# EAGLE design SparkFun_Qwiic_Thermocouple_Amplifier_Screw_Terminals (EAGLE 9.4.1)
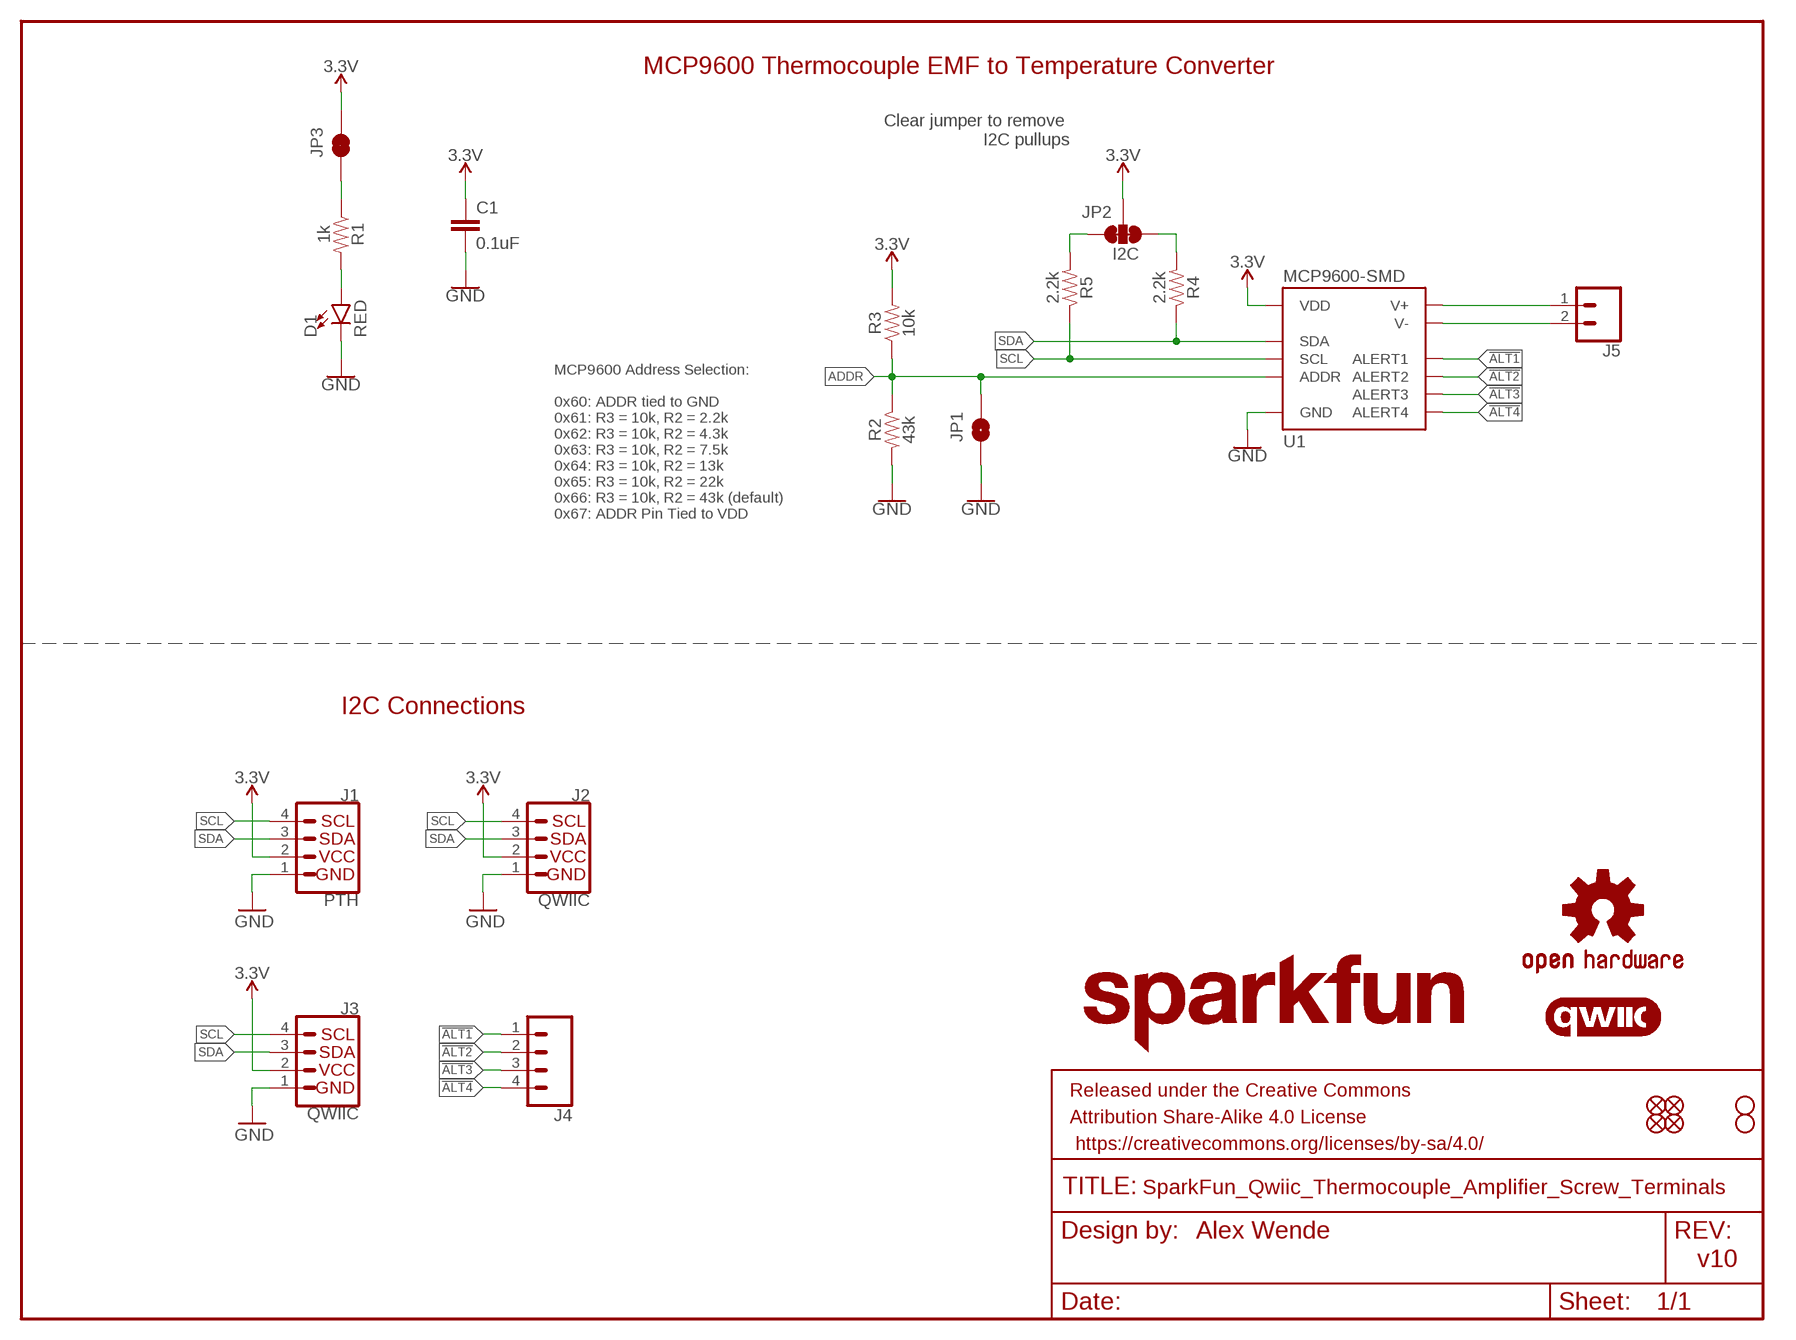
[diagram p0: schematic, sheet 1]

## Parts
C1  0.1uF  0.1UF-0603-25V-(+80/-20%)  [0603]
D1  RED  LED-RED0603  [LED-0603]
FD1  FIDUCIALUFIDUCIAL  [FIDUCIAL-MICRO]
FD2  FIDUCIALUFIDUCIAL  [FIDUCIAL-MICRO]
FD3  FIDUCIALUFIDUCIAL  [FIDUCIAL-MICRO]
FD4  FIDUCIALUFIDUCIAL  [FIDUCIAL-MICRO]
FRAME1  FRAME-LETTER  [CREATIVE_COMMONS]
J1  PTH  I2C_STANDARD_NO_SILK  [1X04_NO_SILK]
J2  QWIIC  QWIIC_CONNECTORJS-1MM  [JST04_1MM_RA]
J3  QWIIC  QWIIC_CONNECTORJS-1MM  [JST04_1MM_RA]
J4  CONN_041X04_NO_SILK  [1X04_NO_SILK]
J5  CONN_023.5MM  [SCREWTERMINAL-3.5MM-2]
JP1  JUMPER-SMT_2_NO_SILK  [SMT-JUMPER_2_NO_SILK]
JP2  I2C  JUMPER-SMT_3_2-NC_TRACE_SILK  [SMT-JUMPER_3_2-NC_TRACE_SILK]
JP3  JUMPER-SMT_2_NC_TRACE_SILK  [SMT-JUMPER_2_NC_TRACE_SILK]
JP8  STAND-OFF  [STAND-OFF]
JP9  STAND-OFF  [STAND-OFF]
LOGO1  OSHW-LOGOMINI  [OSHW-LOGO-MINI]
LOGO2  SFE_LOGO_NAME.1_INCH  [SFE_LOGO_NAME_.1]
LOGO3  QWIIC_LOGO_5MM  [QWIIC_5MM]
R1  1k  1KOHM-0603-1/10W-1%  [0603]
R2  43k  43KOHM-0603-1/10W-1%  [0603]
R3  10k  10KOHM-0603-1/10W-1%  [0603]
R4  2.2k  2.2KOHM-0603-1/10W-1%  [0603]
R5  2.2k  2.2KOHM-0603-1/10W-1%  [0603]
U1  MCP9600-SMD  [MQFN-20]

## Nets
3.3V: C1.1 J1.2 J2.2 J3.2 JP2.2 JP3.1 R3.2 U1.8(VDD)
!ALT1: J4.1 U1.11(ALERT1)
!ALT2: J4.2 U1.12(ALERT2)
!ALT3: J4.3 U1.14(ALERT3)
!ALT4: J4.4 U1.15(ALERT4)
ADDR: JP1.1 R2.1 R3.1 U1.16(ADDR)
GND: C1.2 D1.C J1.1 J2.1 J3.1 JP1.2 R2.2 U1.1(GND) U1.3(GND) U1.5(GND) U1.6(GND) U1.7(GND) U1.9(GND) U1.10(GND) U1.13(GND) U1.17(GND) U1.18(GND) U1.21(GND)
N$1: D1.A R1.2
N$2: JP2.1 R5.2
N$3: JP2.3 R4.2
N$4: J5.1 U1.2(V+)
N$5: J5.2 U1.4(V-)
N$6: JP3.2 R1.1
SCL: J1.4 J2.4 J3.4 R5.1 U1.19(SCL)
SDA: J1.3 J2.3 J3.3 R4.1 U1.20(SDA)

## Notes on the sheet
- MCP9600 Thermocouple EMF to Temperature Converter
- Clear jumper to remove 
  I2C pullups
- MCP9600 Address Selection:
  
  0x60: ADDR tied to GND
  0x61: R3 = 10k, R2 = 2.2k
  0x62: R3 = 10k, R2 = 4.3k 
  0x63: R3 = 10k, R2 = 7.5k
  0x64: R3 = 10k, R2 = 13k 
  0x65: R3 = 10k, R2 = 22k
  0x66: R3 = 10k, R2 = 43k (default)
  0x67: ADDR Pin Tied to VDD
- I2C Connections
- Alex Wende
- v10

## Library data of the parts
C1 = SparkFun-Capacitors:0.1UF: 0.1µF ceramic capacitors A capacitor is a passive two-terminal electrical component used to store electrical energy temporarily in an electric field.; PROD_ID: CAP-00810
D1 = SparkFun-LED:LED-RED: Red SMD LED Used in manufacturing of most products at SparkFun Packages: 0603 - SMD 0603 package [Product Link] <http://docs.avagotech.com/docs/AV02-0551EN> 0603 SMART - SMD 0603 SMART package ( more efficient and expensive)[Product Link] <http://www.osram-os.com/Graphics/XPic2/00077099_0.pdf> 1206 - SMD1206 package [Product Link] <https://www.sparkfun.com/datasheets/DevTools/LilyPad/Q150OVS4.pdff> SparkFun Products: Pro Mini 328 -5V <https://www.sparkfun.com/products/821> RedBoard <https://www.sparkfun.com/products/12757> IOIO-OTG <https://www.sparkfun.com/products/13613>; PROD_ID: DIO-00819
FD1-FD4 = SparkFun-Aesthetics:FIDUCIAL: Fiducial Alignment Points Point-of-reference for pick-and-place machines and other optical instruments.
FRAME1 = SparkFun-Aesthetics:FRAME-LETTER: Schematic Frame - Letter Standard 8.5x11 US Letter frame
J1 = SparkFun-Connectors:I2C_STANDARD: SparkFun I2C Standard Pinout Header SparkFun has standardized on a pinout for all I2C based sensor breakouts. This pinout allows I2C boards to be plugged directly into the headers on Arduino Uno compatible boards, and to be daisy chained easily. Example SparkFun Products: SparkFun Atmospheric Sensor Breakout - BME280 <https://www.sparkfun.com/products/13676> SparkFun Altitude/Pressure Sensor Breakout - MPL3115A2 <https://www.sparkfun.com/products/11084> SparkFun TOF Range Finder Sensor - VL6180 <https://www.sparkfun.com/products/12785>
J2 J3 = SparkFun-Connectors:QWIIC_CONNECTOR: SparkFun I2C Standard Qwiic Connector An SMD 1mm pitch JST connector makes it easy and quick (get it? Qwiic?) to connect I2C devices to each other. The Qwiic system <http://www.sparkfun.com/qwiic> enables fast and solderless connection between popular platforms and various sensors and actuators. We carry 200mm <https://www.sparkfun.com/products/14204>, 100mm <https://www.sparkfun.com/products/14205>, 50mm <https://www.sparkfun.com/products/14206>, and breadboard friendly <https://www.sparkfun.com/products/14207> Qwiic cables. We also offer 10 pcs strips <https://www.sparkfun.com/products/14323> the SMD connectors.; PROD_ID: CONN-13694; VALUE: QWIIC_RIGHT_ANGLE
J4 = SparkFun-Connectors:CONN_04: Multi connection point. Often used as Generic Header-pin footprint for 0.1 inch spaced/style header connections On any of the 0.1 inch spaced packages, you can populate with these: Break Away Headers - Straight <https://www.sparkfun.com/products/116> (PRT-00116) Break Away Male Headers - Right Angle <https://www.sparkfun.com/products/553> (PRT-00553) Female Headers <https://www.sparkfun.com/products/115> (PRT-00115) Break Away Headers - Machine Pin <https://www.sparkfun.com/products/117> (PRT-00117) Break Away Female Headers - Swiss Machine Pin <https://www.sparkfun.com/products/743> (PRT-00743) For SCREWTERMINALS and SPRING TERMINALS visit here: Screw Terimnals on SparkFun.com <https://www.sparkfun.com/search/results?term=Screw+Terminals> (5mm/3.5mm/2.54mm spacing) This device is also useful as a general connection point to wire up your design to another part of your project. Our various solder wires solder well into these plated through hole pads. Hook-Up Wire - Assortment (Stranded, 22 AWG) <https://www.sparkfun.com/products/11375> (PRT-11375) Hook-Up Wire - Assortment (Solid Core, 22 AWG) <https://www.sparkfun.com/products/11367> (PRT-11367) View the entire wire category on our website here <https://www.sparkfun.com/categories/141> Special notes: Molex polarized connector foot print use with SKU : PRT-08231 with associated crimp pins and housings. 1MM SMD Version SKU: PRT-10208; PROD_ID: CONN-09696
J5 = SparkFun-Connectors:CONN_02: Multi connection point. Often used as Generic Header-pin footprint for 0.1 inch spaced/style header connections On any of the 0.1 inch spaced packages, you can populate with these: Break Away Headers - Straight <https://www.sparkfun.com/products/116> (PRT-00116) Break Away Male Headers - Right Angle <https://www.sparkfun.com/products/553> (PRT-00553) Female Headers <https://www.sparkfun.com/products/115> (PRT-00115) Break Away Headers - Machine Pin <https://www.sparkfun.com/products/117> (PRT-00117) Break Away Female Headers - Swiss Machine Pin <https://www.sparkfun.com/products/743> (PRT-00743) For SCREWTERMINALS and SPRING TERMINALS visit here: Screw Terimnals on SparkFun.com <https://www.sparkfun.com/search/results?term=Screw+Terminals> (5mm/3.5mm/2.54mm spacing) This device is also useful as a general connection point to wire up your design to another part of your project. Our various solder wires solder well into these plated through hole pads. Hook-Up Wire - Assortment (Stranded, 22 AWG) <https://www.sparkfun.com/products/11375> (PRT-11375) Hook-Up Wire - Assortment (Solid Core, 22 AWG) <https://www.sparkfun.com/products/11367> (PRT-11367) View the entire wire category on our website here <https://www.sparkfun.com/categories/141> Special notes: Molex polarized connector foot print use with: PRT-08233 with associated crimp pins and housings. 2.54_SCREWTERM for use with PRT-10571. 3.5mm Screw Terminal footprints for PRT-08084 5mm Screw Terminal footprints for use with PRT-08432; PROD_ID: CONN-08399
JP1 = SparkFun-Jumpers:JUMPER-SMT_2_NO: Normally open jumper This jumper has two pads in close proximity to each other. Apply solder to close the connection. Round pads are easier to solder for beginners, but are a lot larger. SparkFun Product that uses the round pads: SparkFun EL Sequencer <https://www.sparkfun.com/products/12781>
JP2 = SparkFun-Jumpers:JUMPER-SMT_3_2-NC_TRACE: Normally closed trace jumper (2 of 2 connections) This jumper has a trace between all three pads so they are normally closed (NC). Use a razor knife to open the connection(s). For best results follow the IPC guidelines for cutting traces: Cutout at least 0.063 mm (0.005 in). Remove all loose material to clean up the cut area. Seal the cut with an approved epoxy. Reapply solder to reclose the connection(s).
JP3 = SparkFun-Jumpers:JUMPER-SMT_2_NC_TRACE: Normally closed trace jumper This jumper has a trace between two pads so it's normally closed (NC). Use a razor knife to open the connection. For best results follow the IPC guidelines for cutting traces: Cutout at least 0.063 mm (0.005 in). Remove all loose material to clean up the cut area. Seal the cut with an approved epoxy. Reapply solder to reclose the connection.
JP8 JP9 = SparkFun:STAND-OFF: Stand Off This is the mechanical footprint for a #4 phillips button head screw. Use the keepout ring to avoid running the screw head into surrounding components. SKU : PRT-00447
LOGO1 = SparkFun-Aesthetics:OSHW-LOGO: Open-Source Hardware (OSHW) Logo This logo indicates the piece of hardware it is found on incorporates a OSHW license and/or adheres to the definition of open source hardware found here: http://freedomdefined.org/OSHW
LOGO2 = SparkFun-Aesthetics:SFE_LOGO_NAME: SparkFun Font Logo This is the SparkFun name logo. The logo on the schematic will always be the same size; the package variant is the height of the flame part of the logo (or the height the flame would be, if it were drawn). Default layer for the logo on the board is tSilk.
LOGO3 = SparkFun-Aesthetics:QWIIC_LOGO: Qwiic Logos for placement on schematic and PCB. The 5.5mm silk logo is best for placing next to Qwiic connector.
R1 = SparkFun-Resistors:1KOHM: 1kΩ resistor A resistor is a passive two-terminal electrical component that implements electrical resistance as a circuit element. Resistors act to reduce current flow, and, at the same time, act to lower voltage levels within circuits. - Wikipedia; PROD_ID: RES-07856
R2 = SparkFun-Resistors:43KOHM: 43kΩ resistor A resistor is a passive two-terminal electrical component that implements electrical resistance as a circuit element. Resistors act to reduce current flow, and, at the same time, act to lower voltage levels within circuits. - Wikipedia; PROD_ID: RES-07858
R3 = SparkFun-Resistors:10KOHM: 10kΩ resistor A resistor is a passive two-terminal electrical component that implements electrical resistance as a circuit element. Resistors act to reduce current flow, and, at the same time, act to lower voltage levels within circuits. - Wikipedia; PROD_ID: RES-00824
R4 R5 = SparkFun-Resistors:2.2KOHM: 2.2kΩ resistor A resistor is a passive two-terminal electrical component that implements electrical resistance as a circuit element. Resistors act to reduce current flow, and, at the same time, act to lower voltage levels within circuits. - Wikipedia; PROD_ID: RES-08272
U1 = SparkFun-IC-Conversion:MCP9600: Thermocouple EMF to Temperature Converter; PROD_ID: IC-14644

## Board
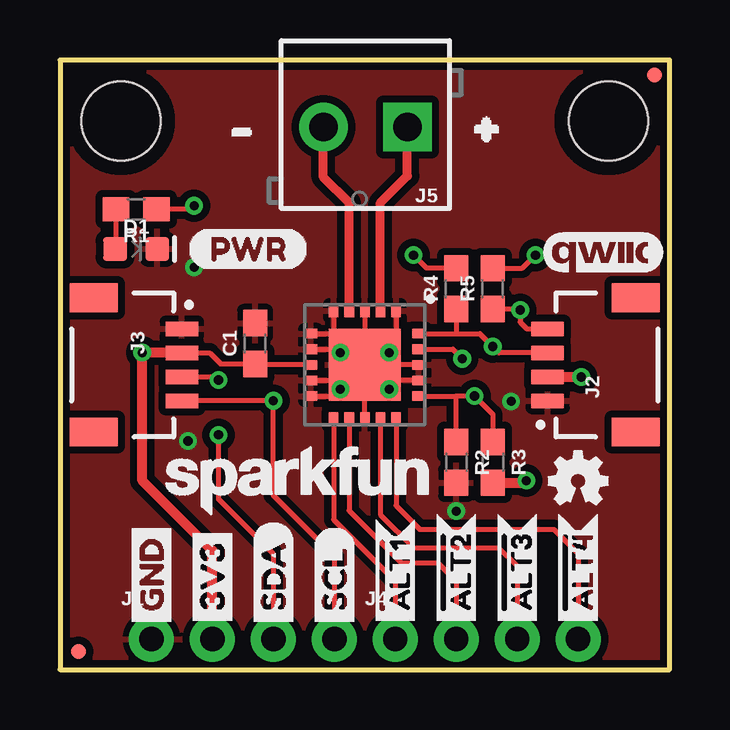
[diagram p1: board, top side]
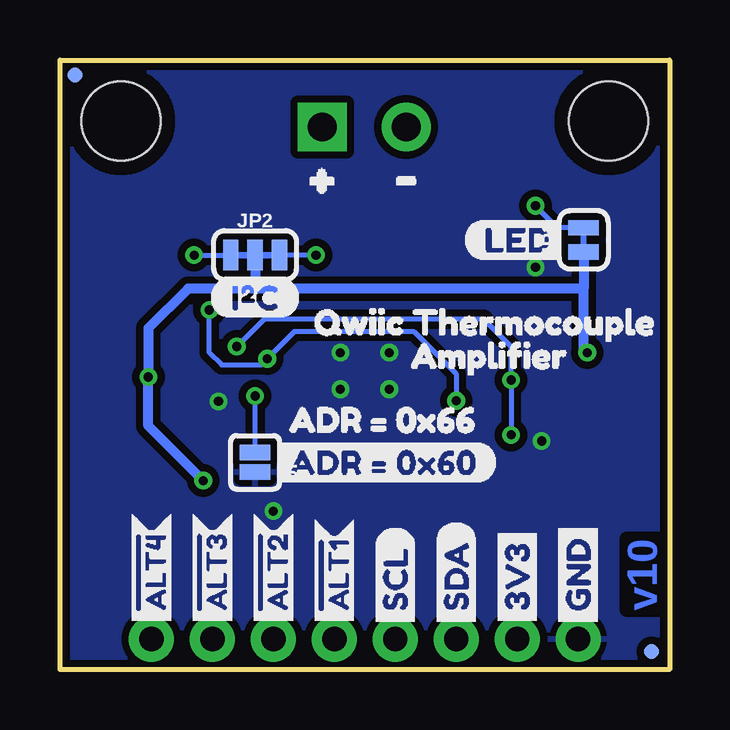
[diagram p2: board, bottom side, seen from below]

Size 25.4 x 25.4 mm. Coordinates in mm from the lower left corner, seen from the top.
Outline: 0,0 25.4,0 25.4,25.4 0,25.4 0,0
Copper layers (1*16): Top 0.035mm / dielectric 1.5mm / Bottom 0.035mm
Design rules "SparkFun-2-layer-TIGHT": minimum track width 7mil, minimum drill 15mil, track to track 7mil, track to pad 7mil, pad to pad 7mil, via to via 7mil, smd to smd 7mil, copper to edge 7mil, drill to drill 7mil, minimum pad ring 7mil, minimum via ring 7mil, stop-mask expansion 4mil, vias tented up to drill 25mil, thermal gap 10mil
tRestrict: 3 lines

### Footprints (pad centres in the part's own frame; a part is rotated, then mirrored left to right if it is on the bottom)
0603 = smd 1.1 x 1: 1 -0.85,0; 2 0.85,0
LED-0603 = smd 1 x 1: A -0.877,0; C 0.877,0
FIDUCIAL-MICRO = smd 0.635 x 0.635: 1 0,0
1X04_NO_SILK = drill 1.016 pad 1.88: 1 0,0; 2 2.54,0; 3 5.08,0; 4 7.62,0
JST04_1MM_RA = smd 0.6 x 1.35: 1 -1.5,0; 2 -0.5,0; 3 0.5,0; 4 1.5,0 | smd 1.2 x 2: NC1 2.8,-3.675; NC2 -2.8,-3.675
SCREWTERMINAL-3.5MM-2 = drill 1.2 pad 2.032 square: 1 0,0 | drill 1.2 pad 2.032: 2 3.5,0
SMT-JUMPER_2_NO_SILK = smd 0.635 x 1.27: 1 -0.406,0; 2 0.406,0
SMT-JUMPER_3_2-NC_TRACE_SILK = smd 0.635 x 1.27: 1 -1.016,0; 2 0,0; 3 1.016,0
SMT-JUMPER_2_NC_TRACE_SILK = smd 0.635 x 1.27: 1 -0.508,0; 2 0.508,0
STAND-OFF = hole 3.302: 0,0
MQFN-20 = smd 0.55 x 0.4: 1 -2.25,1.3; 2 -2.25,0.65; 3 -2.25,0; 4 -2.25,-0.65; 5 -2.25,-1.3; 11 2.25,-1.3; 12 2.25,-0.65; 13 2.25,0; 14 2.25,0.65; 15 2.25,1.3 | smd 0.4 x 0.55: 6 -1.3,-2.25; 7 -0.65,-2.25; 8 0,-2.25; 9 0.65,-2.25; 10 1.3,-2.25; 16 1.3,2.25; 17 0.65,2.25; 18 0,2.25; 19 -0.65,2.25; 20 -1.3,2.25 | smd 3 x 3: 21 0,0

### Placement (x,y rotation side)
C1  8.13,13.59 90 top
D1  3.17,17.53 0 top
FD1  24.77,24.77 0 bottom
FD2  24.77,24.77 0 top
FD3  0.76,0.76 0 bottom
FD4  0.76,0.76 0 top
FRAME1  -10.16,-21.59 0 top  (outside the outline)
J1  3.81,1.27 0 top
J2  20.32,12.7 90 top
J3  5.08,12.7 270 top
J4  13.97,1.27 0 top
J5  14.48,22.61 180 top
JP1  17.27,8.64 270 bottom
JP2  17.27,17.27 0 bottom
JP3  3.58,17.91 90 bottom
JP8  22.86,22.86 0 top
JP9  2.54,22.86 0 top
LOGO1  21.59,7.87 0 top
LOGO2  9.91,7.87 0 top
LOGO3  22.61,17.4 0 top
R1  3.17,19.18 180 top
R2  16.51,8.64 270 top
R3  18.03,8.64 270 top
R4  16.51,15.88 90 top
R5  18.03,15.88 90 top
U1  12.7,12.7 270 top
U$1  [GND0]  3.81,1.52 90 top
U$2  [3V31]  6.35,1.52 90 top
U$3  [SDA2]  8.89,1.52 90 top
U$4  [SCL3]  11.43,1.52 90 top
U$5  [#ALT14]  13.97,1.4 90 top
U$6  [#ALT25]  16.51,1.4 90 top
U$7  [#ALT36]  19.05,1.4 90 top
U$8  [#ALT47]  21.59,1.4 90 top
U$9  [PWR8]  5.33,17.53 0 top
U$10  [ADR_#_0X660]  16.76,10.41 0 bottom
U$11  [#2]  15.88,22.73 0 top
U$12  [#3]  5.71,22.73 0 top
U$13  [#ALT14]  13.97,1.4 90 bottom
U$14  [#ALT25]  16.51,1.4 90 bottom
U$15  [#ALT36]  19.05,1.4 90 bottom
U$16  [#ALT47]  21.59,1.4 90 bottom
U$17  [SCL3]  11.43,1.52 90 bottom
U$18  [SDA2]  8.89,1.52 90 bottom
U$19  [3V31]  6.35,1.52 90 bottom
U$20  [GND0]  3.81,1.52 90 bottom
U$21  [#3]  12.83,20.7 0 bottom
U$22  [#2]  16.38,20.57 0 bottom
U$23  [ADR_#_0X600]  16.76,8.64 0 bottom
U$24  [LED0]  8.64,17.91 0 bottom
U$25  [I#C0]  19.18,15.49 0 bottom
U$26  [QWIIC_THERMOCOUPLE2]  15.75,14.48 0 bottom
U$27  [AMPLIFIER1]  11.68,13.08 0 bottom

### Tracks (layer width: path | path; a pad name or v marks a point on that pad's centre or on a via)
3.3V  (via drill 0.38)
  Top 0.203: U1.8 8.17,12.7 C1.1 6.69,12.74 6.23,13.2 J3.2
  Top 0.406: J2.2 21.71,12.2 v21.72,12.19 | J3.2 v3.44,13.2 | v3.44,13.2 v3.43,13.21 | R3.2 19.34,7.79 v19.43,7.87 | J1.2 6.35,4.95 3.43,7.87 3.43,13.19 v3.44,13.2
  Bottom 0.406: v3.43,13.21 3.58,13.36 3.58,15.88 | v19.43,7.87 21.72,10.16 v21.72,12.19 21.72,14.22 20.07,15.88 17.27,15.88 | 3.58,15.88 17.27,15.88 | JP2.2 17.27,15.88 | JP3.1 3.58,15.88
!ALT1
  Top 0.203: U1.11 11.4,6.25 13.84,3.81 13.97,3.68 J4.1
!ALT2
  Top 0.203: U1.12 12.05,6.62 14.22,4.45 15.75,4.45 16.51,3.68 J4.2
!ALT3
  Top 0.203: U1.14 13.35,6.46 14.73,5.08 18.29,5.08 19.05,4.32 J4.3
!ALT4
  Top 0.203: U1.15 14,6.83 14.99,5.84 20.57,5.84 21.59,4.83 J4.4
ADDR  (via drill 0.38)
  Top 0.203: U1.16 16.51,11.4 | 16.51,11.4 v17.27,11.4 18.03,10.64 R3.1 | R2.1 16.51,11.4
  Bottom 0.203: JP1.1 v17.27,11.4
GND  (via drill 0.38)
  Top 0.203: U1.6 11.4,14 | U1.7 12.05,13.35 U1.21 | U1.9 12.05,12.05 U1.21 | U1.10 11.4,11.4 v11.68,11.68 U1.21 | U1.17 13.35,12.05 U1.21 | U1.18 12.83,12.7 | 12.83,12.7 U1.21 | U1.13 U1.21 | U1.1 14,13.87 12.83,12.7 | U1.3 U1.21 | U1.5 11.4,14 | 11.4,14 U1.21
  other vias: 16.51,6.6 18.8,11.18 11.68,13.21 13.72,13.21 13.72,11.68 5.59,16.76 5.33,9.53
  pour Bottom (isolate 0.305): 0,0 0,25.4 25.4,25.4 25.4,0
  pour Top (isolate 0.305): 0,0 0,25.4 25.4,25.4 25.4,0
N$1
  Top 0.203: R1.2 2.33,17.55 D1.A
N$2  (via drill 0.38)
  Top 0.203: R5.2 19.27,16.73 v19.81,17.27
  Bottom 0.203: v19.81,17.27 JP2.1
N$3  (via drill 0.38)
  Top 0.203: R4.2 15.28,16.73 v14.73,17.27
  Bottom 0.203: v14.73,17.27 JP2.3
N$4
  Top 0.381: U1.2 13.35,19.45 14.48,20.57 J5.1
N$5
  Top 0.381: U1.4 12.05,19.45 10.98,20.52 J5.2
N$6  (via drill 0.38)
  Top 0.203: v5.59,19.33 5.44,19.18 R1.1
  Bottom 0.203: JP3.2 4.67,18.41 v5.59,19.33
SCL  (via drill 0.38)
  Top 0.203: J2.4 19.45,14.2 19.18,14.48 v19.18,14.99 19.14,15.03 R5.1 | J1.4 11.43,4.72 8.89,7.26 v8.89,11.2 J3.4 | U1.19 16.37,13.35 v16.76,12.95
  Bottom 0.203: v19.18,14.99 19.18,13.21 18.67,12.7 17.02,12.7 v16.76,12.95 15.62,14.1 10.67,14.1 8.89,12.32 v8.89,11.2
SDA  (via drill 0.38)
  Top 0.203: J2.3 18.3,13.2 v18.03,13.46 17.5,14 16.51,14 | U1.20 16.51,14 | R4.1 16.51,14 | J3.3 6.47,12.2 v6.6,12.06 | v6.6,9.78 6.6,7.11 8.89,4.83 J1.3
  Bottom 0.203: v18.03,13.46 16.89,14.61 7.75,14.61 6.6,13.46 v6.6,12.06 v6.6,9.78

### Text on the board
Bottom: v10
tDocu: Alex Wende